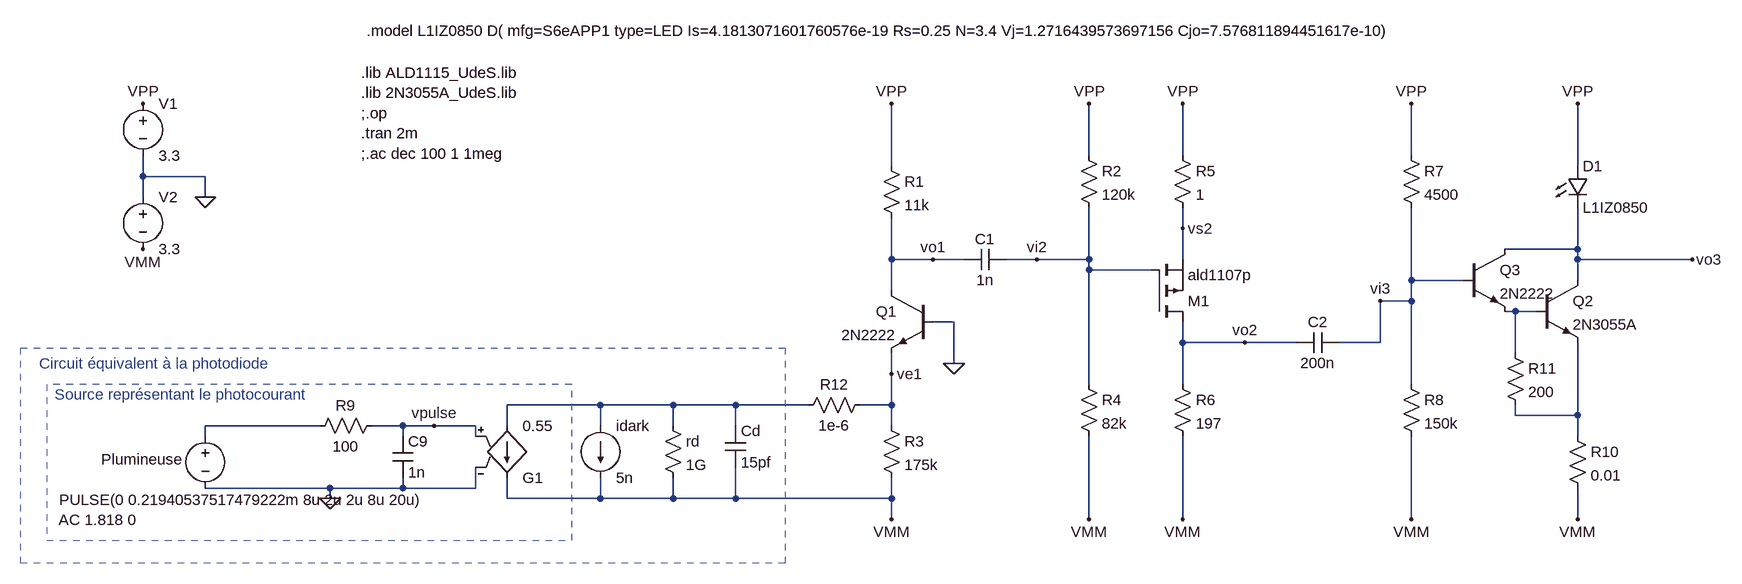
[diagram p0: schematic circuit_total.asc]
circuit_total.asc, the LTspice schematic file:
Version 4
SHEET 1 2260 1556
WIRE 480 32 480 -48
WIRE 624 32 624 -48
WIRE 976 32 976 -48
WIRE 176 48 176 -48
WIRE 1232 48 1232 -48
WIRE -976 64 -976 32
WIRE -880 64 -976 64
WIRE -976 96 -976 64
WIRE -880 96 -880 64
WIRE 624 144 624 112
WIRE 1232 176 1232 112
WIRE 1232 176 1120 176
WIRE 176 192 176 128
WIRE 240 192 176 192
WIRE 288 192 240 192
WIRE 400 192 352 192
WIRE 480 192 480 112
WIRE 480 192 400 192
WIRE 624 192 624 144
WIRE 1232 192 1232 176
WIRE 1408 192 1232 192
WIRE 480 208 480 192
WIRE 576 208 480 208
WIRE 976 224 976 112
WIRE 1056 224 976 224
WIRE 1232 224 1232 192
WIRE 176 240 176 192
WIRE 976 256 976 224
WIRE 976 256 928 256
WIRE 1136 272 1120 272
WIRE 1168 272 1136 272
WIRE 272 288 240 288
WIRE 624 320 624 288
WIRE 720 320 624 320
WIRE 800 320 720 320
WIRE 928 320 928 256
WIRE 928 320 864 320
WIRE 1136 336 1136 272
WIRE 272 352 272 288
WIRE 176 368 176 336
WIRE 480 384 480 208
WIRE 624 384 624 320
WIRE 976 384 976 256
WIRE -272 416 -416 416
WIRE -160 416 -272 416
WIRE -64 416 -160 416
WIRE 48 416 -64 416
WIRE 176 416 176 368
WIRE 176 416 128 416
WIRE 1136 432 1136 416
WIRE 1232 432 1232 320
WIRE 1232 432 1136 432
WIRE -704 448 -880 448
WIRE -576 448 -624 448
WIRE -528 448 -576 448
WIRE -464 448 -528 448
WIRE -416 448 -416 416
WIRE -272 448 -272 416
WIRE -160 448 -160 416
WIRE -64 448 -64 416
WIRE 176 448 176 416
WIRE -880 464 -880 448
WIRE -576 464 -576 448
WIRE -464 464 -464 448
WIRE 1232 464 1232 432
WIRE -688 544 -880 544
WIRE -576 544 -576 528
WIRE -576 544 -688 544
WIRE -464 544 -464 512
WIRE -464 544 -576 544
WIRE -688 560 -688 544
WIRE -416 560 -416 528
WIRE -272 560 -272 528
WIRE -272 560 -416 560
WIRE -160 560 -160 528
WIRE -160 560 -272 560
WIRE -64 560 -64 512
WIRE -64 560 -160 560
WIRE 176 560 176 528
WIRE 176 560 -64 560
WIRE 176 592 176 560
WIRE 480 592 480 464
WIRE 624 592 624 464
WIRE 976 592 976 464
WIRE 1232 592 1232 544
FLAG 272 352 0
FLAG 176 -48 VPP
FLAG -976 -48 VPP
FLAG -976 176 VMM
FLAG -880 96 0
FLAG 176 592 VMM
FLAG 240 192 vo1
FLAG 176 368 ve1
FLAG 480 -48 VPP
FLAG 480 592 VMM
FLAG 624 -48 VPP
FLAG 624 592 VMM
FLAG 400 192 vi2
FLAG 720 320 vo2
FLAG 624 144 vs2
FLAG 976 -48 VPP
FLAG 976 592 VMM
FLAG 1232 -48 VPP
FLAG 1232 592 VMM
FLAG 928 256 vi3
FLAG 1408 192 vo3
FLAG -688 560 0
FLAG -528 448 vpulse
SYMBOL /npn 240 240 M0
SYMATTR InstName Q1
SYMATTR Value 2N2222
SYMBOL /res 160 32 R0
SYMATTR InstName R1
SYMATTR Value 11k
SYMBOL /voltage -976 -64 R0
WINDOW 123 0 0 Left 0
WINDOW 39 0 0 Left 0
SYMATTR InstName V1
SYMATTR Value 3.3
SYMBOL /res 160 432 R0
SYMATTR InstName R3
SYMATTR Value 175k
SYMBOL /voltage -976 80 R0
WINDOW 123 0 0 Left 0
WINDOW 39 0 0 Left 0
SYMATTR InstName V2
SYMATTR Value 3.3
SYMBOL /current -272 448 R0
WINDOW 123 0 0 Left 0
WINDOW 39 0 0 Left 0
SYMATTR InstName idark
SYMATTR Value 5n
SYMBOL /res -176 432 R0
SYMATTR InstName rd
SYMATTR Value 1G
SYMBOL /pmos 576 288 M180
SYMATTR InstName M1
SYMATTR Value ald1107p
SYMATTR Prefix X
SYMBOL /res 464 16 R0
SYMATTR InstName R2
SYMATTR Value 120k
SYMBOL /res 464 368 R0
SYMATTR InstName R4
SYMATTR Value 82k
SYMBOL /res 608 16 R0
SYMATTR InstName R5
SYMATTR Value 1
SYMBOL /res 608 368 R0
SYMATTR InstName R6
SYMATTR Value 197
SYMBOL /cap 352 176 R90
WINDOW 0 0 32 VBottom 2
WINDOW 3 32 32 VTop 2
SYMATTR InstName C1
SYMATTR Value 1n
SYMBOL /res 960 16 R0
SYMATTR InstName R7
SYMATTR Value 4500
SYMBOL /res 960 368 R0
SYMATTR InstName R8
SYMATTR Value 150k
SYMBOL /res 1216 448 R0
SYMATTR InstName R10
SYMATTR Value 0.01
SYMBOL /cap -80 448 R0
SYMATTR InstName Cd
SYMATTR Value 15pf
SYMBOL LED 1216 48 R0
SYMATTR InstName D1
SYMATTR Value L1IZ0850
SYMBOL npn 1168 224 R0
SYMATTR InstName Q2
SYMATTR Value 2N3055A
SYMBOL /npn 1056 176 R0
SYMATTR InstName Q3
SYMATTR Value 2N2222
SYMBOL /cap 864 304 R90
WINDOW 0 0 32 VBottom 2
WINDOW 3 32 32 VTop 2
SYMATTR InstName C2
SYMATTR Value 200n
SYMBOL g2 -416 544 M180
SYMATTR InstName G1
SYMATTR Value 0.55
SYMBOL res -608 432 R90
WINDOW 0 0 56 VBottom 2
WINDOW 3 32 56 VTop 2
SYMATTR InstName R9
SYMATTR Value 100
SYMBOL cap -592 464 R0
SYMATTR InstName C9
SYMATTR Value 1n
SYMBOL voltage -880 448 R0
WINDOW 3 -225 114 Left 2
WINDOW 123 -226 145 Left 2
WINDOW 39 0 0 Left 0
WINDOW 0 -160 52 Left 2
SYMATTR Value PULSE(0 0.21940537517479222m 8u 2u 2u 8u 20u)
SYMATTR Value2 AC 1.818 0
SYMATTR InstName Plumineuse
SYMBOL res 1120 320 R0
SYMATTR InstName R11
SYMATTR Value 200
SYMBOL res 144 400 R90
WINDOW 0 0 56 VBottom 2
WINDOW 3 32 56 VTop 2
SYMATTR InstName R12
SYMATTR Value 1e-6
TEXT -640 -96 Left 2 !.lib ALD1115_UdeS.lib\n.lib 2N3055A_UdeS.lib\n;.op\n.tran 2m\n;.ac dec 100 1 1meg
TEXT -1112 400 Left 2 ;Source représentant le photocourant
TEXT -1136 352 Left 2 ;Circuit équivalent à la photodiode
TEXT -632 -160 Left 2 !.model L1IZ0850 D( mfg=S6eAPP1 type=LED Is=4.1813071601760576e-19 Rs=0.25 N=3.4 Vj=1.2716439573697156 Cjo=7.576811894451617e-10)
RECTANGLE Normal -1124 624 -316 384 1
RECTANGLE Normal -1164 328 12 660 1

The netlist it stands for:
* circuit_total.asc
Q1 vo1 0 ve1 0 2N2222
R1 VPP vo1 11k
V1 VPP 0 3.3
R3 ve1 VMM 175k
V2 0 VMM 3.3
idark N002 VMM 5n
rd N002 VMM 1G
XM1 vo2 vi2 vs2 ald1107p  ; pins D G S
R2 VPP vi2 120k
R4 vi2 VMM 82k
R5 VPP vs2 1
R6 vo2 VMM 197
C1 vi2 vo1 1n
R7 VPP vi3 4500
R8 vi3 VMM 150k
R10 N003 VMM 0.01
Cd N002 VMM 15pf
D1 VPP vo3 L1IZ0850
Q2 vo3 N001 N003 0 2N3055A
Q3 vo3 vi3 N001 0 2N2222
C2 vi3 vo2 200n
G1 N002 VMM vpulse 0 0.55
R9 vpulse N004 100
C9 vpulse 0 1n
V§Plumineuse N004 0 PULSE(0 0.21940537517479222m 8u 2u 2u 8u 20u) AC 1.818 0
R11 N001 N003 200
R12 ve1 N002 1e-6
.model D D
.lib standard.dio
.model NPN NPN
.model PNP PNP
.lib standard.bjt
.lib ALD1115_UdeS.lib
.lib 2N3055A_UdeS.lib
;.op
.tran 2m
;.ac dec 100 1 1meg
* Source représentant le photocourant
* Circuit équivalent à la photodiode
.model L1IZ0850 D( mfg=S6eAPP1 type=LED Is=4.1813071601760576e-19 Rs=0.25 N=3.4 Vj=1.2716439573697156 Cjo=7.576811894451617e-10)
.backanno
.end